# Altium project PROC154E3_SCH.PrjPcb (part 19 of 60)
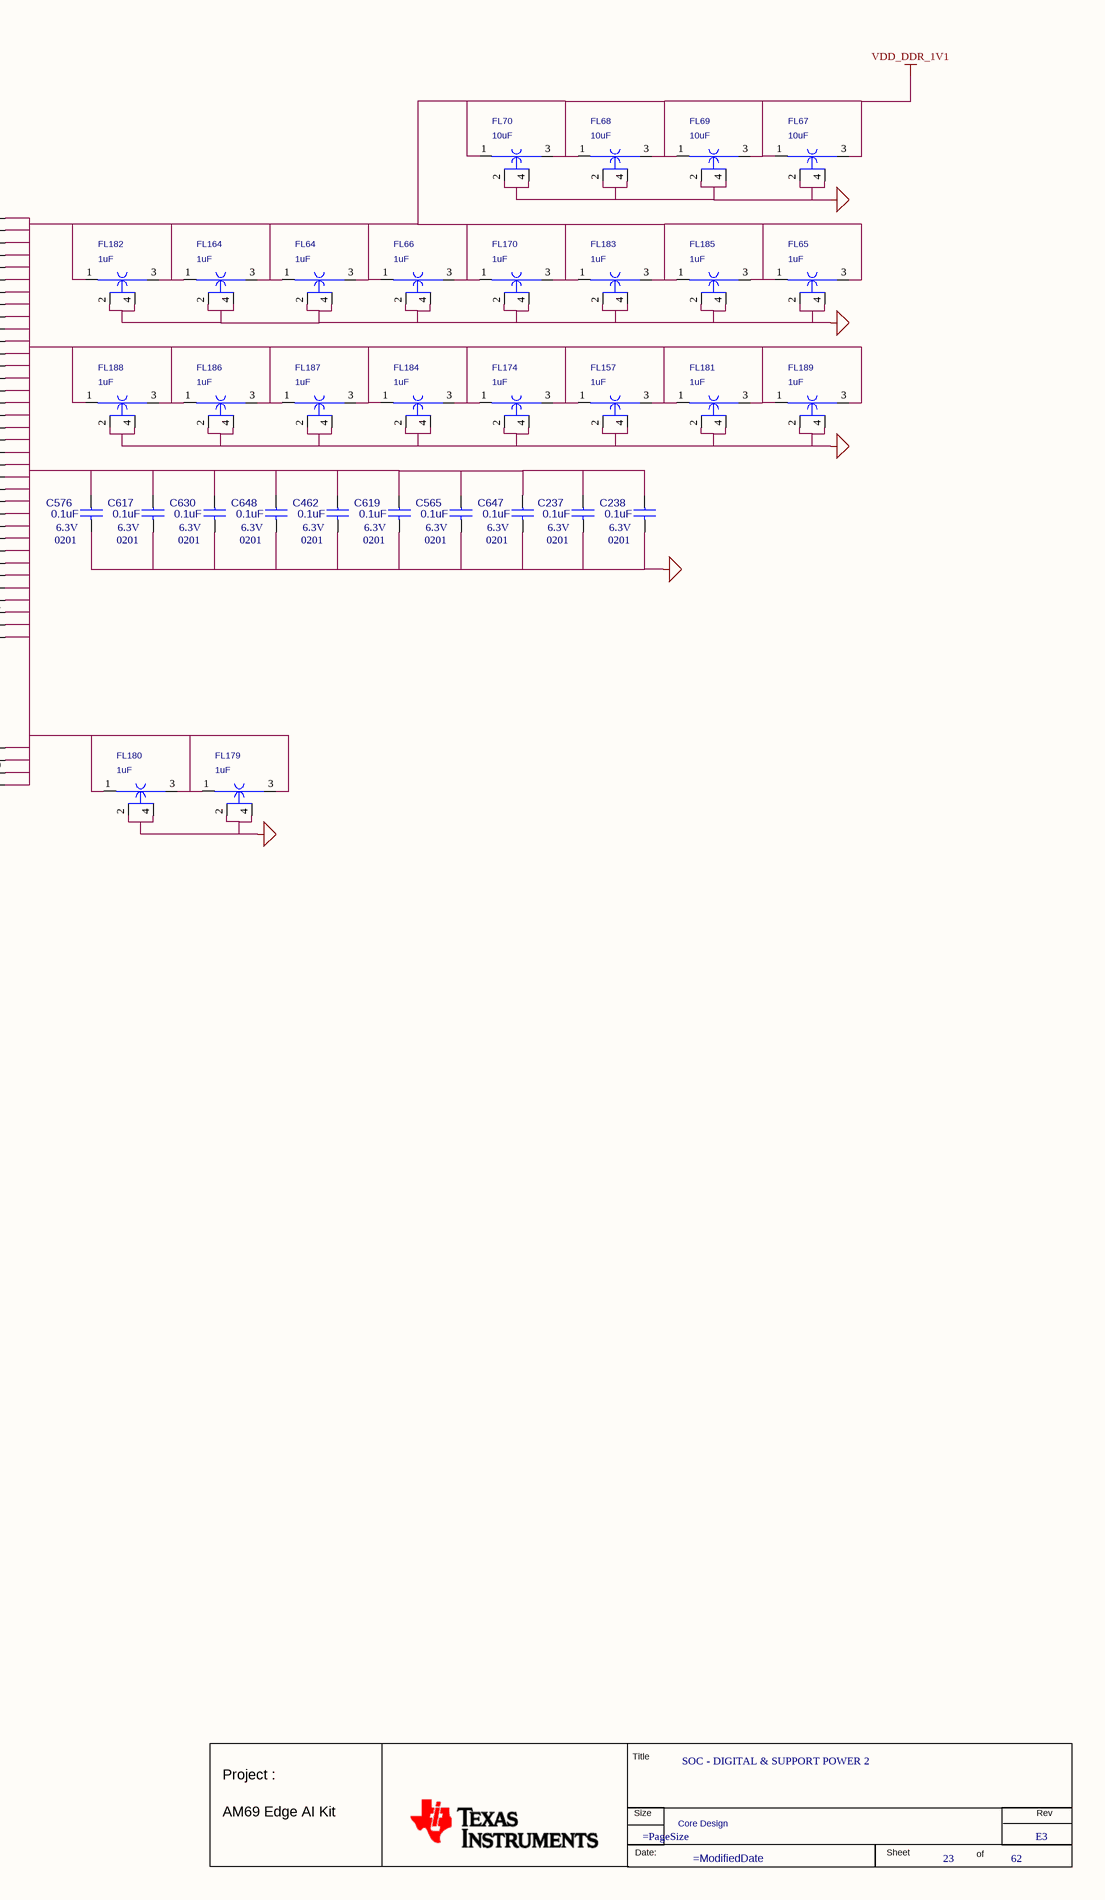
[diagram p138: 23. SOC IO & SUPPORT POWER 2.SchDoc, right]

## Sheet 23. SOC IO & SUPPORT POWER 2.SchDoc: SOC - DIGITAL & SUPPORT POWER 2 (continued)

### Library data of the parts (continued)
FL186 = CAP_NFM_TI: PASSIVE FILTER EMI 1uF 4V AUTO 0402; Part Reference: FL186; Mfr_part_number: NFM15HC105D0G_TI; Mfr_name: MURATA; Mistral Part No: 130018100050; Custom_Duty: 15%; Customs_HS_Code: 85412900; Wattage: NA; Project: TI_J7ES_EVM_SOM; Value: 1uF; Footprint Path: Y:\MIS_DATABASE\Library\ALTIUM_TOOL\PCB_FOOTPRINTS\Altium_Footprint_Lib.PcbLib; Library Path: Y:\MIS_DATABASE\Library\ALTIUM_TOOL\SCHEMATICS_PARTS\MS_FILTER_Library.schlib; MECHANICAL 3D STEP FILE: EMIFIL_NFM15CC_0402_0-5_TI; RoHS: NA; Chkd/date: MANIRAJA/251018; Crtd /date: ALVY/251018; Datasheet: Y:\MIS_DATABASE\DATASHEETS\DISCRETES\INDUCTORS\NFM15CC223C1A3.PDF; Temperature: NA; Weight: NA; Height: 0.50MM; Library Ref: CAP_NFM_TI; Distributor_part_number: NA; Distributor_name: NA; Package: 0402; Voltage: 4V; Tolerance: NA; Part_type: FILTER; Footprint Ref: EMIFIL_NFM15CC_0402_0-5_TI; PCB Footprint: EMIFIL_NFM15CC_0402_0-5_TI
FL187 = CAP_NFM_TI: PASSIVE FILTER EMI 1uF 4V AUTO 0402; Part Reference: FL187; Mfr_part_number: NFM15HC105D0G_TI; Mfr_name: MURATA; Mistral Part No: 130018100050; Custom_Duty: 15%; Customs_HS_Code: 85412900; Wattage: NA; Project: TI_J7ES_EVM_SOM; Value: 1uF; Footprint Path: Y:\MIS_DATABASE\Library\ALTIUM_TOOL\PCB_FOOTPRINTS\Altium_Footprint_Lib.PcbLib; Library Path: Y:\MIS_DATABASE\Library\ALTIUM_TOOL\SCHEMATICS_PARTS\MS_FILTER_Library.schlib; MECHANICAL 3D STEP FILE: EMIFIL_NFM15CC_0402_0-5_TI; RoHS: NA; Chkd/date: MANIRAJA/251018; Crtd /date: ALVY/251018; Datasheet: Y:\MIS_DATABASE\DATASHEETS\DISCRETES\INDUCTORS\NFM15CC223C1A3.PDF; Temperature: NA; Weight: NA; Height: 0.50MM; Library Ref: CAP_NFM_TI; Distributor_part_number: NA; Distributor_name: NA; Package: 0402; Voltage: 4V; Tolerance: NA; Part_type: FILTER; Footprint Ref: EMIFIL_NFM15CC_0402_0-5_TI; PCB Footprint: EMIFIL_NFM15CC_0402_0-5_TI
FL188 = CAP_NFM_TI: PASSIVE FILTER EMI 1uF 4V AUTO 0402; Part Reference: FL188; Mfr_part_number: NFM15HC105D0G_TI; Mfr_name: MURATA; Mistral Part No: 130018100050; Custom_Duty: 15%; Customs_HS_Code: 85412900; Wattage: NA; Project: TI_J7ES_EVM_SOM; Value: 1uF; Footprint Path: Y:\MIS_DATABASE\Library\ALTIUM_TOOL\PCB_FOOTPRINTS\Altium_Footprint_Lib.PcbLib; Library Path: Y:\MIS_DATABASE\Library\ALTIUM_TOOL\SCHEMATICS_PARTS\MS_FILTER_Library.schlib; MECHANICAL 3D STEP FILE: EMIFIL_NFM15CC_0402_0-5_TI; RoHS: NA; Chkd/date: MANIRAJA/251018; Crtd /date: ALVY/251018; Datasheet: Y:\MIS_DATABASE\DATASHEETS\DISCRETES\INDUCTORS\NFM15CC223C1A3.PDF; Temperature: NA; Weight: NA; Height: 0.50MM; Library Ref: CAP_NFM_TI; Distributor_part_number: NA; Distributor_name: NA; Package: 0402; Voltage: 4V; Tolerance: NA; Part_type: FILTER; Footprint Ref: EMIFIL_NFM15CC_0402_0-5_TI; PCB Footprint: EMIFIL_NFM15CC_0402_0-5_TI
FL189 = CAP_NFM_TI: PASSIVE FILTER EMI 1uF 4V AUTO 0402; Part Reference: FL189; Mfr_part_number: NFM15HC105D0G_TI; Mfr_name: MURATA; Mistral Part No: 130018100050; Custom_Duty: 15%; Customs_HS_Code: 85412900; Wattage: NA; Project: TI_J7ES_EVM_SOM; Value: 1uF; Footprint Path: Y:\MIS_DATABASE\Library\ALTIUM_TOOL\PCB_FOOTPRINTS\Altium_Footprint_Lib.PcbLib; Library Path: Y:\MIS_DATABASE\Library\ALTIUM_TOOL\SCHEMATICS_PARTS\MS_FILTER_Library.schlib; MECHANICAL 3D STEP FILE: EMIFIL_NFM15CC_0402_0-5_TI; RoHS: NA; Chkd/date: MANIRAJA/251018; Crtd /date: ALVY/251018; Datasheet: Y:\MIS_DATABASE\DATASHEETS\DISCRETES\INDUCTORS\NFM15CC223C1A3.PDF; Temperature: NA; Weight: NA; Height: 0.50MM; Library Ref: CAP_NFM_TI; Distributor_part_number: NA; Distributor_name: NA; Package: 0402; Voltage: 4V; Tolerance: NA; Part_type: FILTER; Footprint Ref: EMIFIL_NFM15CC_0402_0-5_TI; PCB Footprint: EMIFIL_NFM15CC_0402_0-5_TI
U28 = J7AHPSoC-EVM_BGA1414: IC AM69 SoC EVM MICROPROCESSOR BGA1414; Part Reference: U28; Manufacturer: TEXAS INSTRUMENTS; Part_type: ICS\DIGITAL\MICROPROCESSOR; Mistral Part No: 141230020002; SPLIT_INST: TRUE; SWAP_INFO: (S1+S2+S3+S4+S5+S6+S7+S8+S9+S10+S11+S12+S13+S14+S15+S16+S17+S18+S19+S20+S21+S22+S23+S24+S25+S26); Custom_Duty: 15%; Customs_HS_Code: 85423100; Wattage: NA; Project: TI_J7AHP SK_BRD; Value: XJ784S45AALY; Footprint Path: Y:\MIS_DATABASE\Library\ALTIUM_TOOL\PCB_FOOTPRINTS\Altium_Footprint_Lib.PcbLib; Library Path: Y:\MIS_DATABASE\Library\ALTIUM_TOOL\SCHEMATICS_PARTS\MS_MICROPROCESSOR_Library.schlib; MECHANICAL 3D STEP FILE: BGA1414_31-49_1230X1230_2-7; RoHS: NA; Chkd/date: MANIRAJA/151221; Crtd /date: ALVY/141221; Datasheet: Y:\MIS_DATABASE\DATASHEETS\ICS\DIGITAL\MICROCONTROLLER\J7AHP-SoC-EVM.PDF; Temperature: NA; Weight: NA; Height: 2.70MM; Library Ref: J7AHPSoC-EVM_BGA1414; Distributor_part_number: NA; Distributor_name: NA; Package: BGA1414; Voltage: NA; Tolerance: NA; Mfr_part_number: XJ784S45AALY; Mfr_name: TEXAS INSTRUMENTS; Footprint Ref: BGA1414_31-49_1230X1230_2-7; PCB Footprint: BGA1414_31-49_1230X1230_2-7

## Sheet 24. SOC DIGITAL POWER 3.SchDoc: SOC - DIGITAL POWER 3
size 513 x 386 mm; Project: PROC154E2(001)_SK_AM69; Issue: 1.0; RevCode: E3; Page Create Date: March  8, 1995; Variant Name: Core Design; Schematic Page Number: 24; Page Number: 24; Page Size: C; Comment: MISTRAL_TITLEBLK_CSIZE_1; Page Count: 62; Schematic Page Count: 62; Name: PROC154E2 001 SK AM69; DsnPath: C:\Users\danie\Downloads\sprr466c\PROC154E3_RP\PROC154E3_SCH.DSN; SchematicName: SCHEMATIC1; PageName: 24. SOC DIGITAL POWER 3; PageSize: C; TopSchematic: True
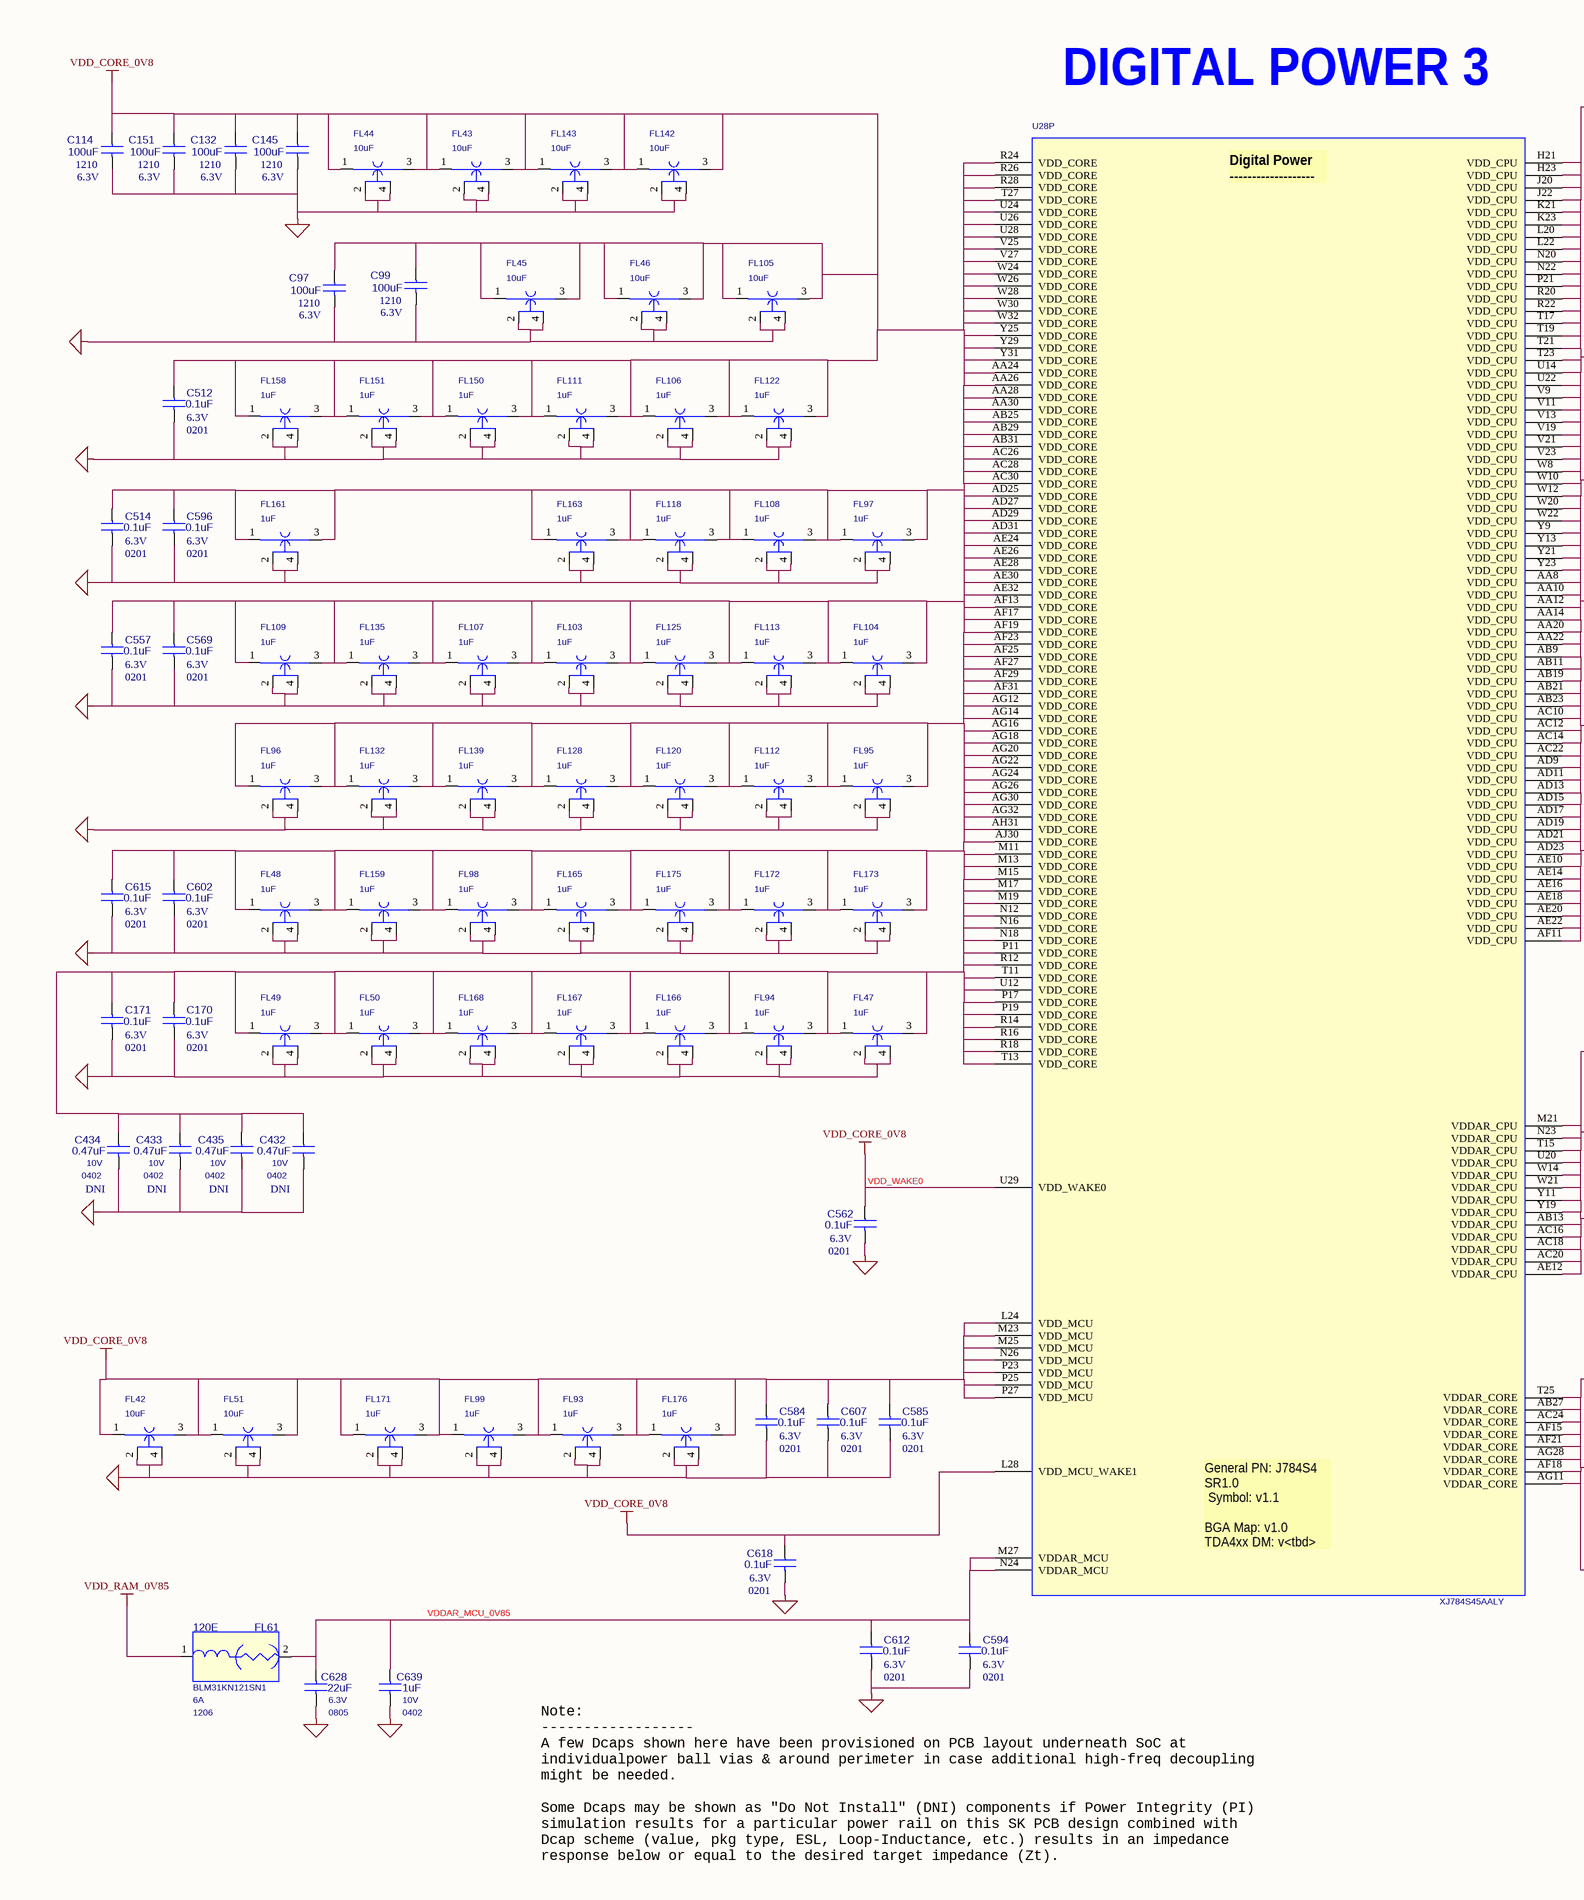
[diagram p36: 24. SOC DIGITAL POWER 3.SchDoc, left]
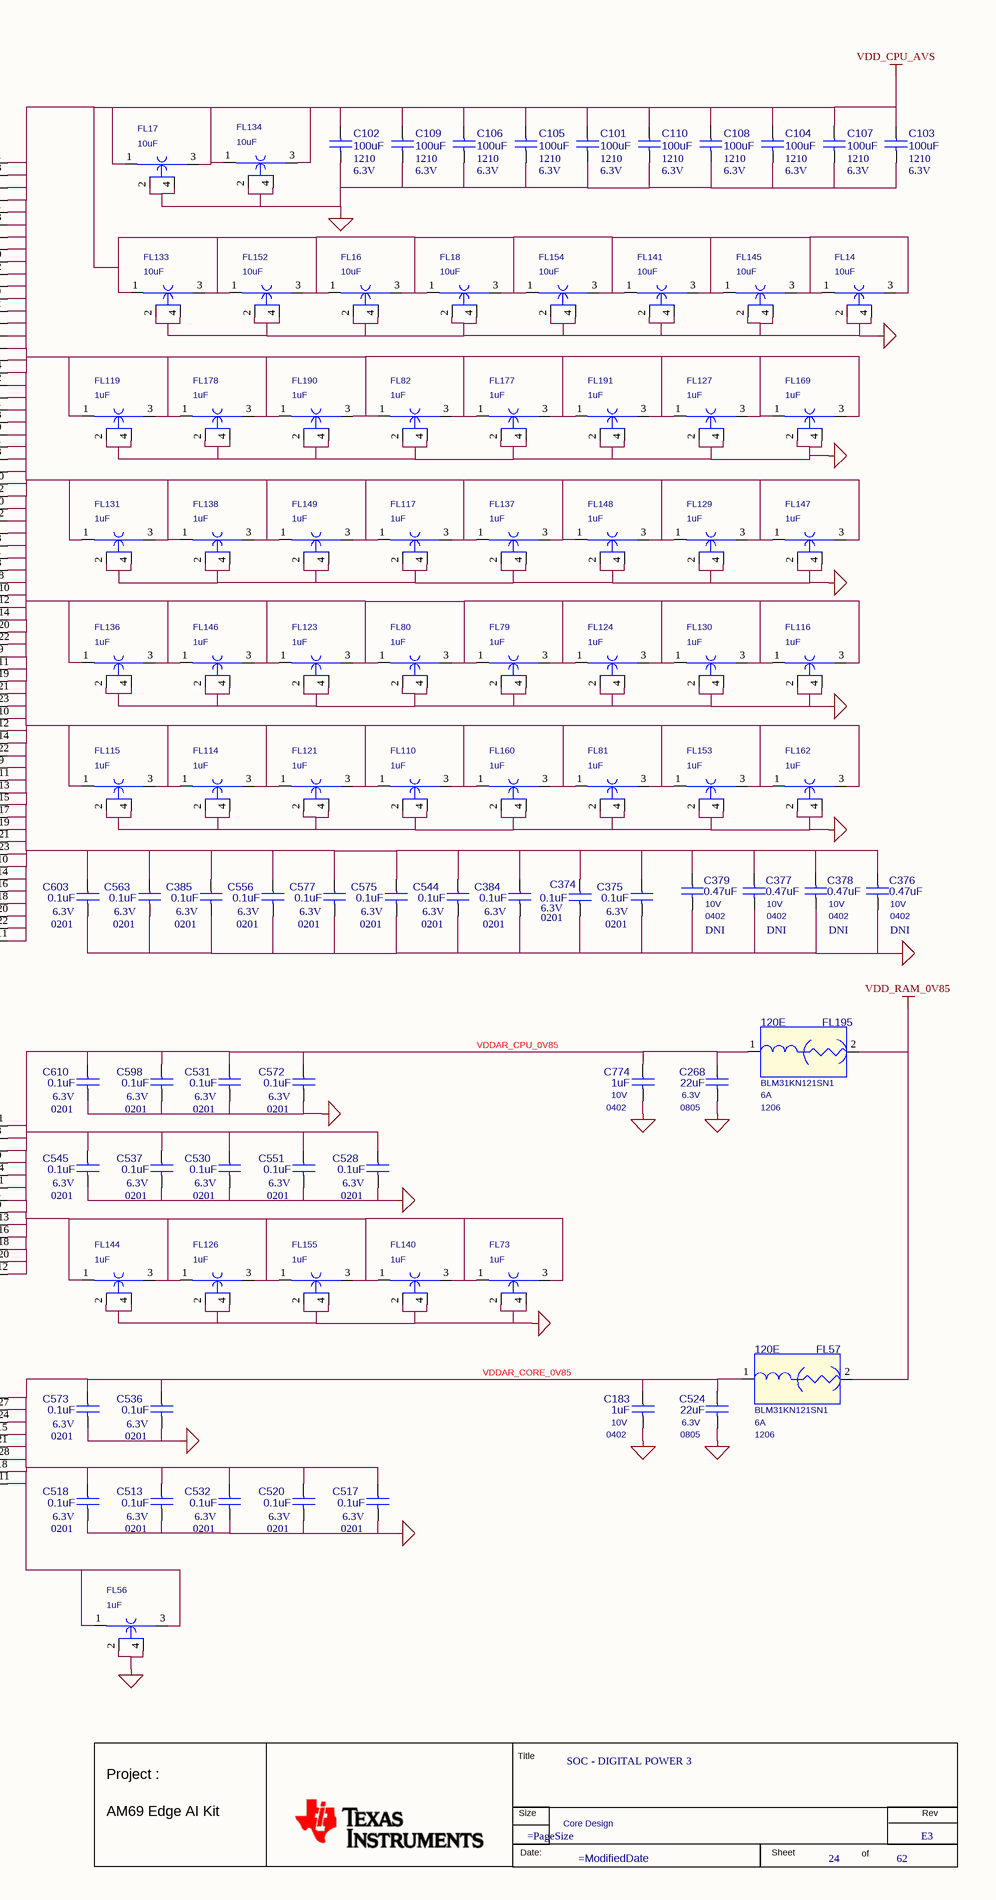
[diagram p37: 24. SOC DIGITAL POWER 3.SchDoc, right]

### Parts
(Parts that share a designator on the sheet are numbered #1, #2 ... from top to bottom, then left to right.)
*#24  RevCode: E3  Title: SOC - DIGITAL POWER 3  Page Number: 24  Page Count: 62  Variant Name: Core Design  (hidden comment: MISTRAL_TITLEBLK_CSIZE_1)  (graphical)
C97  100uF  Voltage: 6.3V  Package: 1210  [CAP1210_2-75]
C99  100uF  Voltage: 6.3V  Package: 1210  [CAP1210_2-75]
C101  100uF  Voltage: 6.3V  Package: 1210  [CAP1210_2-75]
C102  100uF  Voltage: 6.3V  Package: 1210  [CAP1210_2-75]
C103  100uF  Voltage: 6.3V  Package: 1210  [CAP1210_2-75]
C104  100uF  Voltage: 6.3V  Package: 1210  [CAP1210_2-75]
C105  100uF  Voltage: 6.3V  Package: 1210  [CAP1210_2-75]
C106  100uF  Voltage: 6.3V  Package: 1210  [CAP1210_2-75]
C107  100uF  Voltage: 6.3V  Package: 1210  [CAP1210_2-75]
C108  100uF  Voltage: 6.3V  Package: 1210  [CAP1210_2-75]
C109  100uF  Voltage: 6.3V  Package: 1210  [CAP1210_2-75]
C110  100uF  Voltage: 6.3V  Package: 1210  [CAP1210_2-75]
C114  100uF  Voltage: 6.3V  Package: 1210  [CAP1210_2-75]
C132  100uF  Voltage: 6.3V  Package: 1210  [CAP1210_2-75]
C145  100uF  Voltage: 6.3V  Package: 1210  [CAP1210_2-75]
C151  100uF  Package: 1210  Voltage: 6.3V  [CAP1210_2-75]
C170  0.1uF  Package: 0201  Voltage: 6.3V  [CAP0201_0-5]
C171  0.1uF  Voltage: 6.3V  Package: 0201  [CAP0201_0-5]
C183  1uF  Package: 0402  Voltage: 10V  [CAP0402_0-75]
C268  22uF  Package: 0805  Voltage: 6.3V  [CAP0805_1-25]
C374  0.1uF  Voltage: 6.3V  Package: 0201  [CAP0201_0-5]
C375  0.1uF  Voltage: 6.3V  Package: 0201  [CAP0201_0-5]
C376  0.47uF  Assembly_Instruction: DNI  Package: 0402  Voltage: 10V  [CAP0402_0-75]
C377  0.47uF  Assembly_Instruction: DNI  Voltage: 10V  Package: 0402  [CAP0402_0-75]
C378  0.47uF  Package: 0402  Voltage: 10V  Assembly_Instruction: DNI  [CAP0402_0-75]
C379  0.47uF  Package: 0402  Voltage: 10V  Assembly_Instruction: DNI  [CAP0402_0-75]
C384  0.1uF  Package: 0201  Voltage: 6.3V  [CAP0201_0-5]
C385  0.1uF  Voltage: 6.3V  Package: 0201  [CAP0201_0-5]
C432  0.47uF  Assembly_Instruction: DNI  Voltage: 10V  Package: 0402  [CAP0402_0-75]
C433  0.47uF  Assembly_Instruction: DNI  Voltage: 10V  Package: 0402  [CAP0402_0-75]
C434  0.47uF  Voltage: 10V  Package: 0402  Assembly_Instruction: DNI  [CAP0402_0-75]
C435  0.47uF  Package: 0402  Voltage: 10V  Assembly_Instruction: DNI  [CAP0402_0-75]
C512  0.1uF  Package: 0201  Voltage: 6.3V  [CAP0201_0-5]
C513  0.1uF  Package: 0201  Voltage: 6.3V  [CAP0201_0-5]
C514  0.1uF  Voltage: 6.3V  Package: 0201  [CAP0201_0-5]
C517  0.1uF  Package: 0201  Voltage: 6.3V  [CAP0201_0-5]
C518  0.1uF  Package: 0201  Voltage: 6.3V  [CAP0201_0-5]
C520  0.1uF  Package: 0201  Voltage: 6.3V  [CAP0201_0-5]
C524  22uF  Voltage: 6.3V  Package: 0805  [CAP0805_1-25]
C528  0.1uF  Package: 0201  Voltage: 6.3V  [CAP0201_0-5]
C530  0.1uF  Package: 0201  Voltage: 6.3V  [CAP0201_0-5]
C531  0.1uF  Voltage: 6.3V  Package: 0201  [CAP0201_0-5]
C532  0.1uF  Package: 0201  Voltage: 6.3V  [CAP0201_0-5]
C536  0.1uF  Package: 0201  Voltage: 6.3V  [CAP0201_0-5]
C537  0.1uF  Package: 0201  Voltage: 6.3V  [CAP0201_0-5]
C544  0.1uF  Voltage: 6.3V  Package: 0201  [CAP0201_0-5]
C545  0.1uF  Package: 0201  Voltage: 6.3V  [CAP0201_0-5]
C551  0.1uF  Package: 0201  Voltage: 6.3V  [CAP0201_0-5]
C556  0.1uF  Package: 0201  Voltage: 6.3V  [CAP0201_0-5]
C557  0.1uF  Voltage: 6.3V  Package: 0201  [CAP0201_0-5]
C562  0.1uF  Package: 0201  Voltage: 6.3V  [CAP0201_0-5]
C563  0.1uF  Voltage: 6.3V  Package: 0201  [CAP0201_0-5]
C569  0.1uF  Package: 0201  Voltage: 6.3V  [CAP0201_0-5]
C572  0.1uF  Voltage: 6.3V  Package: 0201  [CAP0201_0-5]
C573  0.1uF  Package: 0201  Voltage: 6.3V  [CAP0201_0-5]
C575  0.1uF  Package: 0201  Voltage: 6.3V  [CAP0201_0-5]
C577  0.1uF  Voltage: 6.3V  Package: 0201  [CAP0201_0-5]
C584  0.1uF  Package: 0201  Voltage: 6.3V  [CAP0201_0-5]
C585  0.1uF  Package: 0201  Voltage: 6.3V  [CAP0201_0-5]
C594  0.1uF  Voltage: 6.3V  Package: 0201  [CAP0201_0-5]
C596  0.1uF  Package: 0201  Voltage: 6.3V  [CAP0201_0-5]
C598  0.1uF  Voltage: 6.3V  Package: 0201  [CAP0201_0-5]
C602  0.1uF  Package: 0201  Voltage: 6.3V  [CAP0201_0-5]
C603  0.1uF  Package: 0201  Voltage: 6.3V  [CAP0201_0-5]
C607  0.1uF  Voltage: 6.3V  Package: 0201  [CAP0201_0-5]
C610  0.1uF  Voltage: 6.3V  Package: 0201  [CAP0201_0-5]
C612  0.1uF  Package: 0201  Voltage: 6.3V  [CAP0201_0-5]
C615  0.1uF  Voltage: 6.3V  Package: 0201  [CAP0201_0-5]
C618  0.1uF  Voltage: 6.3V  Package: 0201  [CAP0201_0-5]
C628  22uF  Package: 0805  Voltage: 6.3V  [CAP0805_1-25]
C639  1uF  Voltage: 10V  Package: 0402  [CAP0402_0-75]
C774  1uF  Voltage: 10V  Package: 0402  [CAP0402_0-75]
FL14  10uF  [EMIFIL_NFM18C_0603_0-7_TI]
FL16  10uF  [EMIFIL_NFM18C_0603_0-7_TI]
FL17  10uF  [EMIFIL_NFM18C_0603_0-7_TI]
FL18  10uF  [EMIFIL_NFM18C_0603_0-7_TI]
FL42  10uF  [EMIFIL_NFM18C_0603_0-7_TI]
FL43  10uF  [EMIFIL_NFM18C_0603_0-7_TI]
FL44  10uF  [EMIFIL_NFM18C_0603_0-7_TI]
FL45  10uF  [EMIFIL_NFM18C_0603_0-7_TI]
FL46  10uF  [EMIFIL_NFM18C_0603_0-7_TI]
FL47  1uF  [EMIFIL_NFM15CC_0402_0-5_TI]
FL48  1uF  [EMIFIL_NFM15CC_0402_0-5_TI]
FL49  1uF  [EMIFIL_NFM15CC_0402_0-5_TI]
FL50  1uF  [EMIFIL_NFM15CC_0402_0-5_TI]
FL51  10uF  [EMIFIL_NFM18C_0603_0-7_TI]
FL56  1uF  [EMIFIL_NFM15CC_0402_0-5_TI]
FL57  120E  SAT Current: 6A  Package: 1206  Mfr_part_number: BLM31KN121SN1  [EMIFIL_BLM31KN_1206_1-8]
FL61  120E  Mfr_part_number: BLM31KN121SN1  Package: 1206  SAT Current: 6A  [EMIFIL_BLM31KN_1206_1-8]
FL73  1uF  [EMIFIL_NFM15CC_0402_0-5_TI]
FL79  1uF  [EMIFIL_NFM15CC_0402_0-5_TI]
FL80  1uF  [EMIFIL_NFM15CC_0402_0-5_TI]
FL81  1uF  [EMIFIL_NFM15CC_0402_0-5_TI]
FL82  1uF  [EMIFIL_NFM15CC_0402_0-5_TI]
FL93  1uF  [EMIFIL_NFM15CC_0402_0-5_TI]
FL94  1uF  [EMIFIL_NFM15CC_0402_0-5_TI]
FL95  1uF  [EMIFIL_NFM15CC_0402_0-5_TI]
FL96  1uF  [EMIFIL_NFM15CC_0402_0-5_TI]
FL97  1uF  [EMIFIL_NFM15CC_0402_0-5_TI]
FL98  1uF  [EMIFIL_NFM15CC_0402_0-5_TI]
FL99  1uF  [EMIFIL_NFM15CC_0402_0-5_TI]
FL103  1uF  [EMIFIL_NFM15CC_0402_0-5_TI]
FL104  1uF  [EMIFIL_NFM15CC_0402_0-5_TI]
FL105  10uF  [EMIFIL_NFM18C_0603_0-7_TI]
FL106  1uF  [EMIFIL_NFM15CC_0402_0-5_TI]
FL107  1uF  [EMIFIL_NFM15CC_0402_0-5_TI]
FL108  1uF  [EMIFIL_NFM15CC_0402_0-5_TI]
FL109  1uF  [EMIFIL_NFM15CC_0402_0-5_TI]
FL110  1uF  [EMIFIL_NFM15CC_0402_0-5_TI]
FL111  1uF  [EMIFIL_NFM15CC_0402_0-5_TI]
FL112  1uF  [EMIFIL_NFM15CC_0402_0-5_TI]
FL113  1uF  [EMIFIL_NFM15CC_0402_0-5_TI]
FL114  1uF  [EMIFIL_NFM15CC_0402_0-5_TI]
FL115  1uF  [EMIFIL_NFM15CC_0402_0-5_TI]
FL116  1uF  [EMIFIL_NFM15CC_0402_0-5_TI]
FL117  1uF  [EMIFIL_NFM15CC_0402_0-5_TI]
FL118  1uF  [EMIFIL_NFM15CC_0402_0-5_TI]
FL119  1uF  [EMIFIL_NFM15CC_0402_0-5_TI]
FL120  1uF  [EMIFIL_NFM15CC_0402_0-5_TI]
FL121  1uF  [EMIFIL_NFM15CC_0402_0-5_TI]
FL122  1uF  [EMIFIL_NFM15CC_0402_0-5_TI]
FL123  1uF  [EMIFIL_NFM15CC_0402_0-5_TI]
FL124  1uF  [EMIFIL_NFM15CC_0402_0-5_TI]
FL125  1uF  [EMIFIL_NFM15CC_0402_0-5_TI]
FL126  1uF  [EMIFIL_NFM15CC_0402_0-5_TI]
FL127  1uF  [EMIFIL_NFM15CC_0402_0-5_TI]
FL128  1uF  [EMIFIL_NFM15CC_0402_0-5_TI]
FL129  1uF  [EMIFIL_NFM15CC_0402_0-5_TI]
FL130  1uF  [EMIFIL_NFM15CC_0402_0-5_TI]
FL131  1uF  [EMIFIL_NFM15CC_0402_0-5_TI]
FL132  1uF  [EMIFIL_NFM15CC_0402_0-5_TI]
FL133  10uF  [EMIFIL_NFM18C_0603_0-7_TI]
FL134  10uF  [EMIFIL_NFM18C_0603_0-7_TI]
FL135  1uF  [EMIFIL_NFM15CC_0402_0-5_TI]
FL136  1uF  [EMIFIL_NFM15CC_0402_0-5_TI]
FL137  1uF  [EMIFIL_NFM15CC_0402_0-5_TI]
FL138  1uF  [EMIFIL_NFM15CC_0402_0-5_TI]
FL139  1uF  [EMIFIL_NFM15CC_0402_0-5_TI]
FL140  1uF  [EMIFIL_NFM15CC_0402_0-5_TI]
FL141  10uF  [EMIFIL_NFM18C_0603_0-7_TI]
FL142  10uF  [EMIFIL_NFM18C_0603_0-7_TI]
FL143  10uF  [EMIFIL_NFM18C_0603_0-7_TI]
FL144  1uF  [EMIFIL_NFM15CC_0402_0-5_TI]
FL145  10uF  [EMIFIL_NFM18C_0603_0-7_TI]
FL146  1uF  [EMIFIL_NFM15CC_0402_0-5_TI]
FL147  1uF  [EMIFIL_NFM15CC_0402_0-5_TI]
FL148  1uF  [EMIFIL_NFM15CC_0402_0-5_TI]
FL149  1uF  [EMIFIL_NFM15CC_0402_0-5_TI]
FL150  1uF  [EMIFIL_NFM15CC_0402_0-5_TI]
FL151  1uF  [EMIFIL_NFM15CC_0402_0-5_TI]
FL152  10uF  [EMIFIL_NFM18C_0603_0-7_TI]
FL153  1uF  [EMIFIL_NFM15CC_0402_0-5_TI]
FL154  10uF  [EMIFIL_NFM18C_0603_0-7_TI]
FL155  1uF  [EMIFIL_NFM15CC_0402_0-5_TI]
FL158  1uF  [EMIFIL_NFM15CC_0402_0-5_TI]
FL159  1uF  [EMIFIL_NFM15CC_0402_0-5_TI]
FL160  1uF  [EMIFIL_NFM15CC_0402_0-5_TI]
FL161  1uF  [EMIFIL_NFM15CC_0402_0-5_TI]
FL162  1uF  [EMIFIL_NFM15CC_0402_0-5_TI]
FL163  1uF  [EMIFIL_NFM15CC_0402_0-5_TI]
FL165  1uF  [EMIFIL_NFM15CC_0402_0-5_TI]
FL166  1uF  [EMIFIL_NFM15CC_0402_0-5_TI]
FL167  1uF  [EMIFIL_NFM15CC_0402_0-5_TI]
FL168  1uF  [EMIFIL_NFM15CC_0402_0-5_TI]
FL169  1uF  [EMIFIL_NFM15CC_0402_0-5_TI]
FL171  1uF  [EMIFIL_NFM15CC_0402_0-5_TI]
FL172  1uF  [EMIFIL_NFM15CC_0402_0-5_TI]
FL173  1uF  [EMIFIL_NFM15CC_0402_0-5_TI]
FL175  1uF  [EMIFIL_NFM15CC_0402_0-5_TI]
FL176  1uF  [EMIFIL_NFM15CC_0402_0-5_TI]
FL177  1uF  [EMIFIL_NFM15CC_0402_0-5_TI]
FL178  1uF  [EMIFIL_NFM15CC_0402_0-5_TI]
FL190  1uF  [EMIFIL_NFM15CC_0402_0-5_TI]
FL191  1uF  [EMIFIL_NFM15CC_0402_0-5_TI]
FL195  120E  SAT Current: 6A  Package: 1206  Mfr_part_number: BLM31KN121SN1  [EMIFIL_BLM31KN_1206_1-8]
U28  XJ784S45AALY  [BGA1414_31-49_1230X1230_2-7]  (part P of 26)

### Nets
DGND: C97.2 C99.2 C101.2 C102.2 C103.2 C104.2 C105.2 C106.2 C107.2 C108.2 C109.2 C110.2 C114.2 C132.2 C145.2 C151.2 C170.2 C171.2 C183.2 C268.2 C374.2 C375.2 C376.2 C377.2 C378.2 C379.2 C384.2 C385.2 C432.2 C433.2 C434.2 C435.2 C512.2 C513.2 C514.2 C517.2 C518.2 C520.2 C524.2 C528.2 C530.2 C531.2 C532.2 C536.2 C537.2 C544.2 C545.2 C551.2 C556.2 C557.2 C562.2 C563.2 C569.2 C572.2 C573.2 C575.2 C577.2 C584.2 C585.2 C594.2 C596.2 C598.2 C602.2 C603.2 C607.2 C610.2 C612.2 C615.2 C618.2 C628.2 C639.2 C774.2 FL14.2 FL14.4 FL16.2 FL16.4 FL17.2 FL17.4 FL18.2 FL18.4 FL42.2 FL42.4 FL43.2 FL43.4 FL44.2 FL44.4 FL45.2 FL45.4 FL46.2 FL46.4 FL47.2 FL47.4 FL48.2 FL48.4 FL49.2 FL49.4 FL50.2 FL50.4 FL51.2 FL51.4 FL56.2 FL56.4 FL73.2 FL73.4 FL79.2 FL79.4 FL80.2 FL80.4 FL81.2 FL81.4 FL82.2 FL82.4 FL93.2 FL93.4 FL94.2 FL94.4 FL95.2 FL95.4 FL96.2 FL96.4 FL97.2 FL97.4 FL98.2 FL98.4 FL99.2 FL99.4 FL103.2 FL103.4 FL104.2 FL104.4 FL105.2 FL105.4 FL106.2 FL106.4 FL107.2 FL107.4 FL108.2 FL108.4 FL109.2 FL109.4 FL110.2 FL110.4 FL111.2 FL111.4 FL112.2 FL112.4 FL113.2 FL113.4 FL114.2 FL114.4 FL115.2 FL115.4 FL116.2 FL116.4 FL117.2 FL117.4 FL118.2 FL118.4 FL119.2 FL119.4 FL120.2 FL120.4 FL121.2 FL121.4 FL122.2 FL122.4 FL123.2 FL123.4 FL124.2 FL124.4 FL125.2 FL125.4 FL126.2 FL126.4 FL127.2 FL127.4 FL128.2 FL128.4 FL129.2 FL129.4 FL130.2 FL130.4 FL131.2 FL131.4 FL132.2 FL132.4 FL133.2 FL133.4 FL134.2 FL134.4 FL135.2 FL135.4 FL136.2 FL136.4 FL137.2 FL137.4 FL138.2 FL138.4 FL139.2 FL139.4 FL140.2 FL140.4 FL141.2 FL141.4 FL142.2 FL142.4 FL143.2 FL143.4 FL144.2 FL144.4 FL145.2 FL145.4 FL146.2 FL146.4 FL147.2 FL147.4 FL148.2 FL148.4 FL149.2 FL149.4 FL150.2 FL150.4 FL151.2 FL151.4 FL152.2 FL152.4 FL153.2 FL153.4 FL154.2 FL154.4 FL155.2 FL155.4 FL158.2 FL158.4 FL159.2 FL159.4 FL160.2 FL160.4 FL161.2 FL161.4 FL162.2 FL162.4 FL163.2 FL163.4 FL165.2 FL165.4 FL166.2 FL166.4 FL167.2 FL167.4 FL168.2 FL168.4 FL169.2 FL169.4 FL171.2 FL171.4 FL172.2 FL172.4 FL173.2 FL173.4 FL175.2 FL175.4 FL176.2 FL176.4 FL177.2 FL177.4 FL178.2 FL178.4 FL190.2 FL190.4 FL191.2 FL191.4  [project net VDD_CPU_HCPS_GOSNS]
VDD_CPU_AVS: C101.1 C102.1 C103.1 C104.1 C105.1 C106.1 C107.1 C108.1 C109.1 C110.1 C374.1 C375.1 C376.1 C377.1 C378.1 C379.1 C384.1 C385.1 C544.1 C556.1 C563.1 C575.1 C577.1 C603.1 FL14.1 FL14.3 FL16.1 FL16.3 FL17.1 FL17.3 FL18.1 FL18.3 FL79.1 FL79.3 FL80.1 FL80.3 FL81.1 FL81.3 FL82.1 FL82.3 FL110.1 FL110.3 FL114.1 FL114.3 FL115.1 FL115.3 FL116.1 FL116.3 FL117.1 FL117.3 FL119.1 FL119.3 FL121.1 FL121.3 FL123.1 FL123.3 FL124.1 FL124.3 FL127.1 FL127.3 FL129.1 FL129.3 FL130.1 FL130.3 FL131.1 FL131.3 FL133.1 FL133.3 FL134.1 FL134.3 FL136.1 FL136.3 FL137.1 FL137.3 FL138.1 FL138.3 FL141.1 FL141.3 FL145.1 FL145.3 FL146.1 FL146.3 FL147.1 FL147.3 FL148.1 FL148.3 FL149.1 FL149.3 FL152.1 FL152.3 FL153.1 FL153.3 FL154.1 FL154.3 FL160.1 FL160.3 FL162.1 FL162.3 FL169.1 FL169.3 FL177.1 FL177.3 FL178.1 FL178.3 FL190.1 FL190.3 FL191.1 FL191.3 U28.AA8(VDD_CPU) U28.AA10(VDD_CPU) U28.AA12(VDD_CPU) U28.AA14(VDD_CPU) U28.AA20(VDD_CPU) U28.AA22(VDD_CPU) U28.AB9(VDD_CPU) U28.AB11(VDD_CPU) U28.AB19(VDD_CPU) U28.AB21(VDD_CPU) U28.AB23(VDD_CPU) U28.AC10(VDD_CPU) U28.AC12(VDD_CPU) U28.AC14(VDD_CPU) U28.AC22(VDD_CPU) U28.AD9(VDD_CPU) U28.AD11(VDD_CPU) U28.AD13(VDD_CPU) U28.AD15(VDD_CPU) U28.AD17(VDD_CPU) U28.AD19(VDD_CPU) U28.AD21(VDD_CPU) U28.AD23(VDD_CPU) U28.AE10(VDD_CPU) U28.AE14(VDD_CPU) U28.AE16(VDD_CPU) U28.AE18(VDD_CPU) U28.AE20(VDD_CPU) U28.AE22(VDD_CPU) U28.AF11(VDD_CPU) U28.H21(VDD_CPU) U28.H23(VDD_CPU) U28.J20(VDD_CPU) U28.J22(VDD_CPU) U28.K21(VDD_CPU) U28.K23(VDD_CPU) U28.L20(VDD_CPU) U28.L22(VDD_CPU) U28.N20(VDD_CPU) U28.N22(VDD_CPU) U28.P21(VDD_CPU) U28.R20(VDD_CPU) U28.R22(VDD_CPU) U28.T17(VDD_CPU) U28.T19(VDD_CPU) U28.T21(VDD_CPU) U28.T23(VDD_CPU) U28.U14(VDD_CPU) U28.U22(VDD_CPU) U28.V9(VDD_CPU) U28.V11(VDD_CPU) U28.V13(VDD_CPU) U28.V19(VDD_CPU) U28.V21(VDD_CPU) U28.V23(VDD_CPU) U28.W8(VDD_CPU) U28.W10(VDD_CPU) U28.W12(VDD_CPU) U28.W20(VDD_CPU) U28.W22(VDD_CPU) U28.Y9(VDD_CPU) U28.Y13(VDD_CPU) U28.Y21(VDD_CPU) U28.Y23(VDD_CPU)  [project net VDD_CPU_HCPS_VOSNS]
VDD_RAM_0V85: FL57.2 FL61.1 FL195.2
VDD_WAKE0: C97.1 C99.1 C114.1 C132.1 C145.1 C151.1 C170.1 C171.1 C432.1 C433.1 C434.1 C435.1 C512.1 C514.1 C557.1 C562.1 C569.1 C584.1 C585.1 C596.1 C602.1 C607.1 C615.1 C618.1 FL42.1 FL42.3 FL43.1 FL43.3 FL44.1 FL44.3 FL45.1 FL45.3 FL46.1 FL46.3 FL47.1 FL47.3 FL48.1 FL48.3 FL49.1 FL49.3 FL50.1 FL50.3 FL51.1 FL51.3 FL93.1 FL93.3 FL94.1 FL94.3 FL95.1 FL95.3 FL96.1 FL96.3 FL97.1 FL97.3 FL98.1 FL98.3 FL99.1 FL99.3 FL103.1 FL103.3 FL104.1 FL104.3 FL105.1 FL105.3 FL106.1 FL106.3 FL107.1 FL107.3 FL108.1 FL108.3 FL109.1 FL109.3 FL111.1 FL111.3 FL112.1 FL112.3 FL113.1 FL113.3 FL118.1 FL118.3 FL120.1 FL120.3 FL122.1 FL122.3 FL125.1 FL125.3 FL128.1 FL128.3 FL132.1 FL132.3 FL135.1 FL135.3 FL139.1 FL139.3 FL142.1 FL142.3 FL143.1 FL143.3 FL150.1 FL150.3 FL151.1 FL151.3 FL158.1 FL158.3 FL159.1 FL159.3 FL161.1 FL161.3 FL163.1 FL163.3 FL165.1 FL165.3 FL166.1 FL166.3 FL167.1 FL167.3 FL168.1 FL168.3 FL171.1 FL171.3 FL172.1 FL172.3 FL173.1 FL173.3 FL175.1 FL175.3 FL176.1 FL176.3 U28.AA24(VDD_CORE) U28.AA26(VDD_CORE) U28.AA28(VDD_CORE) U28.AA30(VDD_CORE) U28.AB25(VDD_CORE) U28.AB29(VDD_CORE) U28.AB31(VDD_CORE) U28.AC26(VDD_CORE) U28.AC28(VDD_CORE) U28.AC30(VDD_CORE) U28.AD25(VDD_CORE) U28.AD27(VDD_CORE) U28.AD29(VDD_CORE) U28.AD31(VDD_CORE) U28.AE24(VDD_CORE) U28.AE26(VDD_CORE) U28.AE28(VDD_CORE) U28.AE30(VDD_CORE) U28.AE32(VDD_CORE) U28.AF13(VDD_CORE) U28.AF17(VDD_CORE) U28.AF19(VDD_CORE) U28.AF23(VDD_CORE) U28.AF25(VDD_CORE) U28.AF27(VDD_CORE) U28.AF29(VDD_CORE) U28.AF31(VDD_CORE) U28.AG12(VDD_CORE) U28.AG14(VDD_CORE) U28.AG16(VDD_CORE) U28.AG18(VDD_CORE) U28.AG20(VDD_CORE) U28.AG22(VDD_CORE) U28.AG24(VDD_CORE) U28.AG26(VDD_CORE) U28.AG30(VDD_CORE) U28.AG32(VDD_CORE) U28.AH31(VDD_CORE) U28.AJ30(VDD_CORE) U28.L24(VDD_MCU) U28.L28(VDD_MCU_WAKE1) U28.M11(VDD_CORE) U28.M13(VDD_CORE) U28.M15(VDD_CORE) U28.M17(VDD_CORE) U28.M19(VDD_CORE) U28.M23(VDD_MCU) U28.M25(VDD_MCU) U28.N12(VDD_CORE) U28.N16(VDD_CORE) U28.N18(VDD_CORE) U28.N26(VDD_MCU) U28.P11(VDD_CORE) U28.P17(VDD_CORE) U28.P19(VDD_CORE) U28.P23(VDD_MCU) U28.P25(VDD_MCU) U28.P27(VDD_MCU) U28.R12(VDD_CORE) U28.R14(VDD_CORE) U28.R16(VDD_CORE) U28.R18(VDD_CORE) U28.R24(VDD_CORE) U28.R26(VDD_CORE) U28.R28(VDD_CORE) U28.T11(VDD_CORE) U28.T13(VDD_CORE) U28.T27(VDD_CORE) U28.U12(VDD_CORE) U28.U24(VDD_CORE) U28.U26(VDD_CORE) U28.U28(VDD_CORE) U28.U29(VDD_WAKE0) U28.V25(VDD_CORE) U28.V27(VDD_CORE) U28.W24(VDD_CORE) U28.W26(VDD_CORE) U28.W28(VDD_CORE) U28.W30(VDD_CORE) U28.W32(VDD_CORE) U28.Y25(VDD_CORE) U28.Y29(VDD_CORE) U28.Y31(VDD_CORE)  [also labelled VDD_CORE_0V8]
VDDAR_CORE_0V85: C183.1 C513.1 C517.1 C518.1 C520.1 C524.1 C532.1 C536.1 C573.1 FL56.1 FL56.3 FL57.1 U28.AB27(VDDAR_CORE) U28.AC24(VDDAR_CORE) U28.AF15(VDDAR_CORE) U28.AF18(VDDAR_CORE) U28.AF21(VDDAR_CORE) U28.AG11(VDDAR_CORE) U28.AG28(VDDAR_CORE) U28.T25(VDDAR_CORE)
VDDAR_CPU_0V85: C268.1 C528.1 C530.1 C531.1 C537.1 C545.1 C551.1 C572.1 C598.1 C610.1 C774.1 FL73.1 FL73.3 FL126.1 FL126.3 FL140.1 FL140.3 FL144.1 FL144.3 FL155.1 FL155.3 FL195.1 U28.AB13(VDDAR_CPU) U28.AC16(VDDAR_CPU) U28.AC18(VDDAR_CPU) U28.AC20(VDDAR_CPU) U28.AE12(VDDAR_CPU) U28.M21(VDDAR_CPU) U28.N23(VDDAR_CPU) U28.T15(VDDAR_CPU) U28.U20(VDDAR_CPU) U28.W14(VDDAR_CPU) U28.W21(VDDAR_CPU) U28.Y11(VDDAR_CPU) U28.Y19(VDDAR_CPU)
VDDAR_MCU_0V85: C594.1 C612.1 C628.1 C639.1 FL61.2 U28.M27(VDDAR_MCU) U28.N24(VDDAR_MCU)

### Notes on the sheet
- DIGITAL POWER 3
- Note:
  ------------------
  A few Dcaps shown here have been provisioned on PCB layout underneath SoC at
  individualpower ball vias & around perimeter in case additional high-freq decoupling
  might be needed.
  Some Dcaps may be shown as "Do Not Install" (DNI) components if Power Integrity (PI)
  simulation results for a particular power rail on this SK PCB design combined with
  Dcap scheme (value, pkg type, ESL, Loop-Inductance, etc.) results in an impedance
  response below or equal to the desired target impedance (Zt).
- (in symbol J7AHPSoC-EVM_BGA1414, part P) Digital Power / -------------------; General PN: J784S4 / SR1.0 / Symbol: v1.1 / BGA Map: v1.0 / TDA4xx DM: v<tbd>
- (in symbol MISTRAL_TITLEBLK_CSIZE_1) Title; Project :; Size; Rev; AM69 Edge AI Kit; Date:; Sheet; of